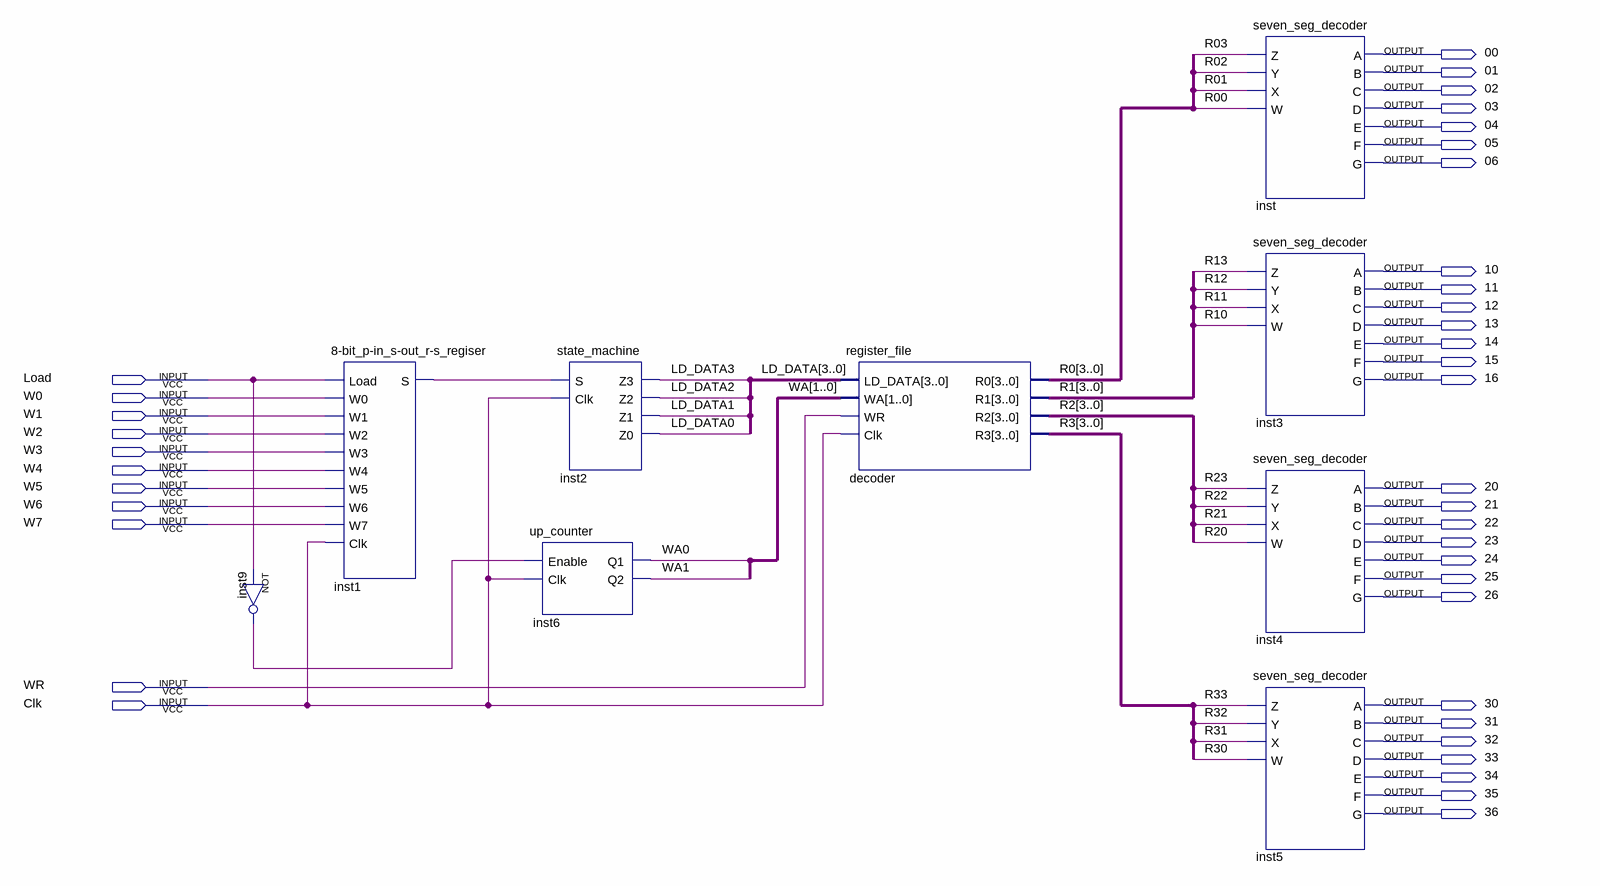
[diagram p0: schematic sheet]
// Quartus schematic Final.bdf as structural Verilog: 9 symbols, 39 pins
module Final (
  input  Load,
  input  W0,
  input  W1,
  input  W2,
  input  W3,
  input  W4,
  input  W5,
  input  W6,
  input  W7,
  input  WR,
  input  Clk,
  output \00 ,
  output \01 ,
  output \02 ,
  output \03 ,
  output \04 ,
  output \05 ,
  output \06 ,
  output \10 ,
  output \11 ,
  output \12 ,
  output \13 ,
  output \14 ,
  output \15 ,
  output \16 ,
  output \20 ,
  output \21 ,
  output \22 ,
  output \23 ,
  output \24 ,
  output \25 ,
  output \26 ,
  output \30 ,
  output \31 ,
  output \32 ,
  output \33 ,
  output \34 ,
  output \35 ,
  output \36 
);

  wire inst1_s, inst9_out;
  wire [1:0] WA;
  wire [3:0] LD_DATA, R0, R1, R2, R3;

  not inst9 (inst9_out, Load);
  \8-bit_p-in_s-out_r-s_regiser  inst1 (
    .Load(Load), .W0(W0), .W1(W1), .W2(W2), .W3(W3), .W4(W4), .W5(W5), .W6(W6), .W7(W7), .Clk(Clk),
    .S(inst1_s));
  up_counter inst6 (.Enable(inst9_out), .Clk(Clk), .Q1(WA[0]), .Q2(WA[1]));
  state_machine inst2 (.S(inst1_s), .Clk(Clk), .Z3(LD_DATA[3]), .Z2(LD_DATA[2]), .Z1(LD_DATA[1]), .Z0(LD_DATA[0]));
  register_file decoder (.LD_DATA(LD_DATA), .WA(WA), .WR(WR), .Clk(Clk), .R0(R0), .R1(R1), .R2(R2), .R3(R3));
  seven_seg_decoder inst (
    .Z(R0[3]), .Y(R0[2]), .X(R0[1]), .W(R0[0]), .A(\00 ), .B(\01 ), .C(\02 ), .D(\03 ), .E(\04 ), .F(\05 ),
    .G(\06 ));
  seven_seg_decoder inst3 (
    .Z(R1[3]), .Y(R1[2]), .X(R1[1]), .W(R1[0]), .A(\10 ), .B(\11 ), .C(\12 ), .D(\13 ), .E(\14 ), .F(\15 ),
    .G(\16 ));
  seven_seg_decoder inst4 (
    .Z(R2[3]), .Y(R2[2]), .X(R2[1]), .W(R2[0]), .A(\20 ), .B(\21 ), .C(\22 ), .D(\23 ), .E(\24 ), .F(\25 ),
    .G(\26 ));
  seven_seg_decoder inst5 (
    .Z(R3[3]), .Y(R3[2]), .X(R3[1]), .W(R3[0]), .A(\30 ), .B(\31 ), .C(\32 ), .D(\33 ), .E(\34 ), .F(\35 ),
    .G(\36 ));
endmodule
